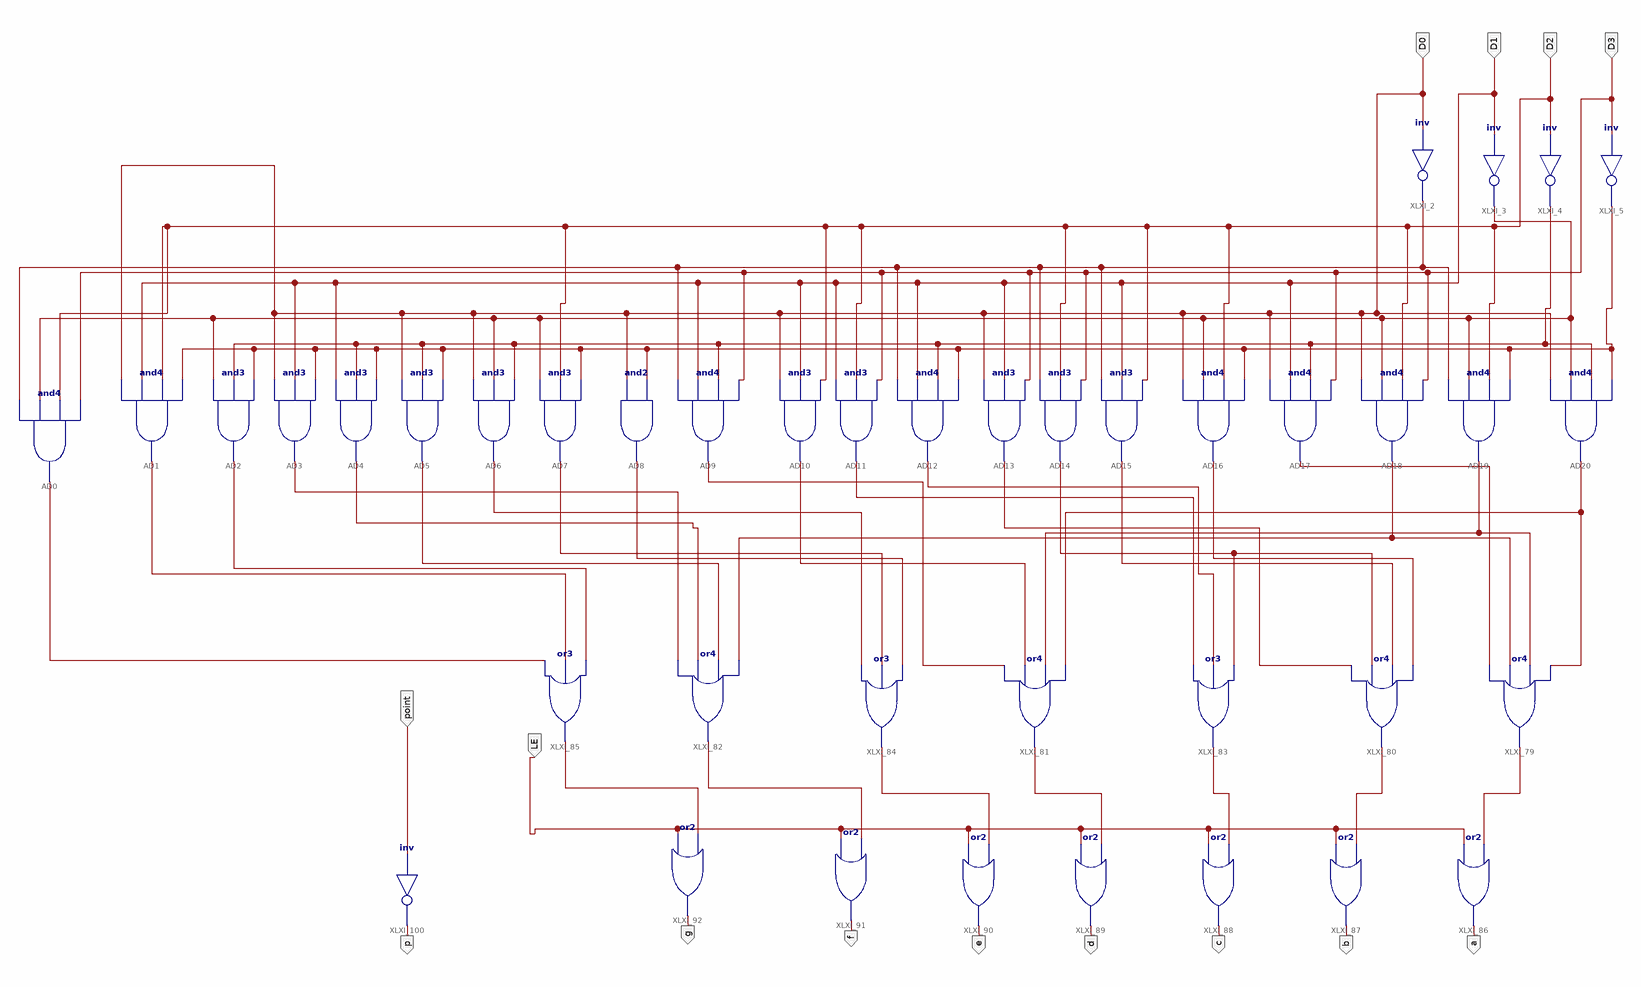
[diagram p0: schematic sheet 1]
// Xilinx ISE schematic MyMC14495.sch (kintex7) as structural Verilog: 40 symbols, 14 ports
module MyMC14495 (
  input  D0,
  input  D1,
  input  D2,
  input  D3,
  input  LE,
  input  point,
  output p,
  output g,
  output f,
  output e,
  output d,
  output c,
  output b,
  output a
);

  wire XLXN_32, XLXN_33, XLXN_34, XLXN_36, XLXN_37, XLXN_38, XLXN_39, XLXN_40, XLXN_41, XLXN_42, XLXN_46,
       XLXN_47, XLXN_48, XLXN_49, XLXN_51, XLXN_52, XLXN_53, XLXN_54, XLXN_55, XLXN_56, XLXN_59, XLXN_60,
       XLXN_62, XLXN_63, XLXN_64, XLXN_65, XLXN_66, XLXN_67, XLXN_68, XLXN_69, XLXN_70, XLXN_77;

  not XLXI_2 (XLXN_36, D0);
  not XLXI_3 (XLXN_34, D1);
  not XLXI_4 (XLXN_32, D2);
  not XLXI_5 (XLXN_33, D3);
  and AD20 (XLXN_37, D0, XLXN_34, XLXN_32, XLXN_33);
  and AD19 (XLXN_38, XLXN_36, XLXN_34, D2, XLXN_33);
  and AD18 (XLXN_39, D0, XLXN_34, D2, D3);
  and AD17 (XLXN_40, D0, D1, XLXN_32, D3);
  and AD16 (XLXN_41, D0, XLXN_34, D2, XLXN_33);
  and AD15 (XLXN_42, XLXN_36, D1, D2);
  and AD14 (XLXN_46, XLXN_36, D2, D3);
  and AD13 (XLXN_47, D0, D1, D3);
  and AD12 (XLXN_48, XLXN_36, D1, XLXN_32, XLXN_33);
  and AD11 (XLXN_49, D1, D2, D3);
  and AD10 (XLXN_51, D0, D1, D2);
  and AD9 (XLXN_52, XLXN_36, D1, XLXN_32, D3);
  and AD8 (XLXN_53, D0, XLXN_33);
  and AD7 (XLXN_54, XLXN_34, D2, XLXN_33);
  and AD6 (XLXN_55, D0, XLXN_34, XLXN_32);
  and AD5 (XLXN_56, D0, XLXN_32, XLXN_33);
  and AD4 (XLXN_59, D1, XLXN_32, XLXN_33);
  and AD3 (XLXN_60, D0, D1, XLXN_33);
  and AD2 (XLXN_62, XLXN_34, XLXN_32, XLXN_33);
  and AD1 (XLXN_63, D0, D1, D2, XLXN_33);
  and AD0 (XLXN_64, XLXN_36, XLXN_34, D2, D3);
  or XLXI_86 (a, LE, XLXN_65);
  or XLXI_87 (b, LE, XLXN_66);
  or XLXI_88 (c, LE, XLXN_67);
  or XLXI_89 (d, LE, XLXN_68);
  or XLXI_90 (e, LE, XLXN_69);
  or XLXI_91 (f, LE, XLXN_70);
  or XLXI_92 (g, LE, XLXN_77);
  or XLXI_79 (XLXN_65, XLXN_40, XLXN_39, XLXN_38, XLXN_37);
  or XLXI_80 (XLXN_66, XLXN_47, XLXN_46, XLXN_42, XLXN_41);
  or XLXI_81 (XLXN_68, XLXN_52, XLXN_51, XLXN_38, XLXN_37);
  or XLXI_82 (XLXN_70, XLXN_60, XLXN_59, XLXN_56, XLXN_39);
  or XLXI_83 (XLXN_67, XLXN_49, XLXN_48, XLXN_46);
  or XLXI_84 (XLXN_69, XLXN_55, XLXN_54, XLXN_53);
  or XLXI_85 (XLXN_77, XLXN_64, XLXN_63, XLXN_62);
  not XLXI_100 (p, point);
endmodule
